# Altium project ECU_AutoRC_r00.PrjPcb
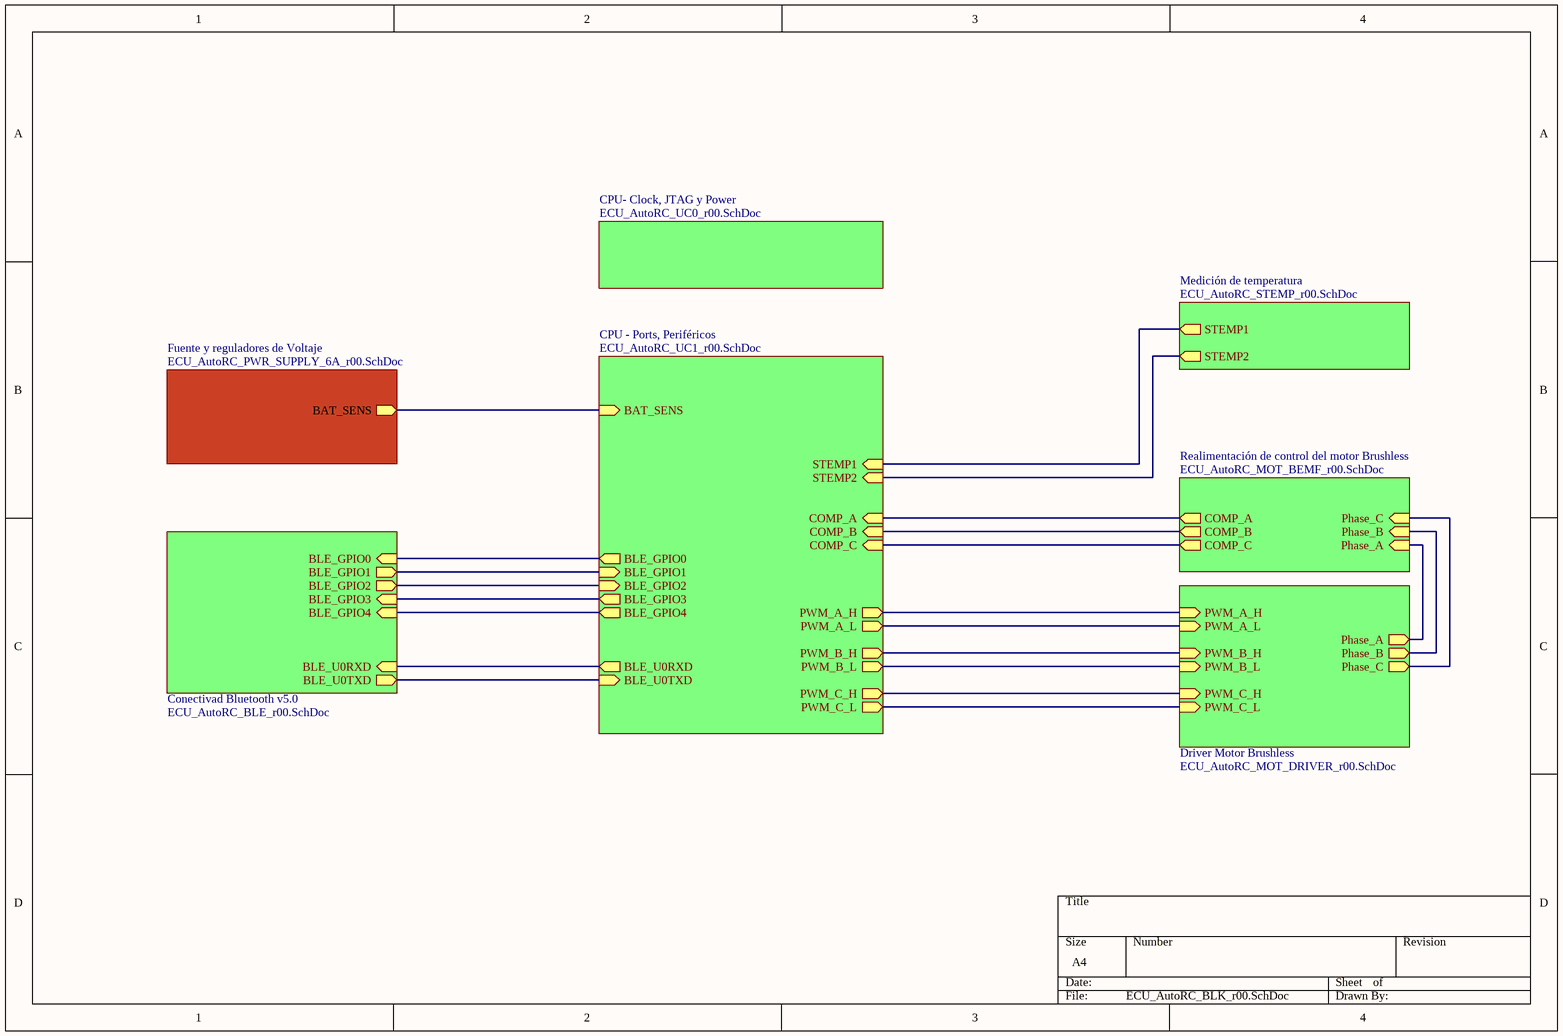
[diagram p0: ECU_AutoRC_BLK_r00.SchDoc]
8 sheets, 179 parts. Net scope: hierarchical (ports join the sheet entries above them; power ports are global).
Board file: ECU_AutoRC_r00.PcbDoc
Sheets:
  ECU_AutoRC_BLK_r00.SchDoc
    Fuente y reguladores de Voltaje = ECU_AutoRC_PWR_SUPPLY_6A_r00.SchDoc
    CPU- Clock, JTAG y Power = ECU_AutoRC_UC0_r00.SchDoc
    CPU - Ports, Periféricos = ECU_AutoRC_UC1_r00.SchDoc
    Medición de temperatura = ECU_AutoRC_STEMP_r00.SchDoc
    Conectivad Bluetooth v5.0 = ECU_AutoRC_BLE_r00.SchDoc
    Driver Motor Brushless = ECU_AutoRC_MOT_DRIVER_r00.SchDoc
    Realimentación de control del motor Brushless = ECU_AutoRC_MOT_BEMF_r00.SchDoc

## Sheet ECU_AutoRC_BLK_r00.SchDoc
size A4; SheetNumber: 1; SheetTotal: 8

### Sub-sheets
Conectivad Bluetooth v5.0 = ECU_AutoRC_BLE_r00.SchDoc: BLE_U0TXD (out), BLE_U0RXD (in), BLE_GPIO1 (out), BLE_GPIO0 (in), BLE_GPIO2 (out), BLE_GPIO3 (in), BLE_GPIO4 (in)
CPU - Ports, Periféricos = ECU_AutoRC_UC1_r00.SchDoc: STEMP1 (in), STEMP2 (in), BLE_GPIO0 (out), BLE_GPIO1 (in), BLE_U0RXD (out), BLE_U0TXD (in), COMP_A (in), COMP_B (in), COMP_C (in), PWM_A_H (out), BAT_SENS (in), PWM_A_L (out), PWM_B_H (out), PWM_B_L (out), PWM_C_H (out), PWM_C_L (out), BLE_GPIO2 (in), BLE_GPIO3 (out), BLE_GPIO4 (out)
CPU- Clock, JTAG y Power = ECU_AutoRC_UC0_r00.SchDoc: no entries
Driver Motor Brushless = ECU_AutoRC_MOT_DRIVER_r00.SchDoc: PWM_C_L (in), PWM_C_H (in), PWM_B_L (in), PWM_B_H (in), PWM_A_L (in), PWM_A_H (in), Phase_A (out), Phase_B (out), Phase_C (out)
Fuente y reguladores de Voltaje = ECU_AutoRC_PWR_SUPPLY_6A_r00.SchDoc: BAT_SENS (out)
Medición de temperatura = ECU_AutoRC_STEMP_r00.SchDoc: STEMP1 (out), STEMP2 (out)
Realimentación de control del motor Brushless = ECU_AutoRC_MOT_BEMF_r00.SchDoc: COMP_A (out), COMP_B (out), COMP_C (out), Phase_A (in), Phase_B (in), Phase_C (in)

### Nets
IO0: sheet CPU - Ports, Periféricos/BLE_GPIO0, sheet Conectivad Bluetooth v5.0/BLE_GPIO0
IO1: sheet CPU - Ports, Periféricos/BLE_GPIO1, sheet Conectivad Bluetooth v5.0/BLE_GPIO1
IO2: sheet CPU - Ports, Periféricos/BLE_GPIO2, sheet Conectivad Bluetooth v5.0/BLE_GPIO2
IO3: sheet CPU - Ports, Periféricos/BLE_GPIO3, sheet Conectivad Bluetooth v5.0/BLE_GPIO3
IO10: sheet CPU - Ports, Periféricos/BLE_GPIO4, sheet Conectivad Bluetooth v5.0/BLE_GPIO4
PH_A: sheet Driver Motor Brushless/Phase_A, sheet Realimentación de control del motor Brushless/Phase_A
PH_B: sheet Driver Motor Brushless/Phase_B, sheet Realimentación de control del motor Brushless/Phase_B
PH_C: sheet Driver Motor Brushless/Phase_C, sheet Realimentación de control del motor Brushless/Phase_C
RXD0: sheet CPU - Ports, Periféricos/BLE_U0RXD, sheet Conectivad Bluetooth v5.0/BLE_U0RXD
TXD0: sheet CPU - Ports, Periféricos/BLE_U0TXD, sheet Conectivad Bluetooth v5.0/BLE_U0TXD
NetR6_1: sheet CPU - Ports, Periféricos/STEMP1, sheet Medición de temperatura/STEMP1
NetR8_2: sheet CPU - Ports, Periféricos/STEMP2, sheet Medición de temperatura/STEMP2
NetR48_2: sheet Fuente y reguladores de Voltaje/BAT_SENS, sheet CPU - Ports, Periféricos/BAT_SENS
NetTP23_1: sheet CPU - Ports, Periféricos/PWM_A_H, sheet Driver Motor Brushless/PWM_A_H
NetTP24_1: sheet CPU - Ports, Periféricos/PWM_A_L, sheet Driver Motor Brushless/PWM_A_L
NetTP26_1: sheet CPU - Ports, Periféricos/PWM_B_H, sheet Driver Motor Brushless/PWM_B_H
NetTP27_1: sheet CPU - Ports, Periféricos/PWM_C_H, sheet Driver Motor Brushless/PWM_C_H
NetTP28_1: sheet CPU - Ports, Periféricos/PWM_B_L, sheet Driver Motor Brushless/PWM_B_L
NetTP29_1: sheet CPU - Ports, Periféricos/PWM_C_L, sheet Driver Motor Brushless/PWM_C_L
NetTP36_1: sheet CPU - Ports, Periféricos/COMP_A, sheet Realimentación de control del motor Brushless/COMP_A
NetTP39_1: sheet CPU - Ports, Periféricos/COMP_B, sheet Realimentación de control del motor Brushless/COMP_B
NetTP40_1: sheet CPU - Ports, Periféricos/COMP_C, sheet Realimentación de control del motor Brushless/COMP_C

## Sheet ECU_AutoRC_PWR_SUPPLY_6A_r00.SchDoc
size A4; SheetNumber: 8; SheetTotal: 8
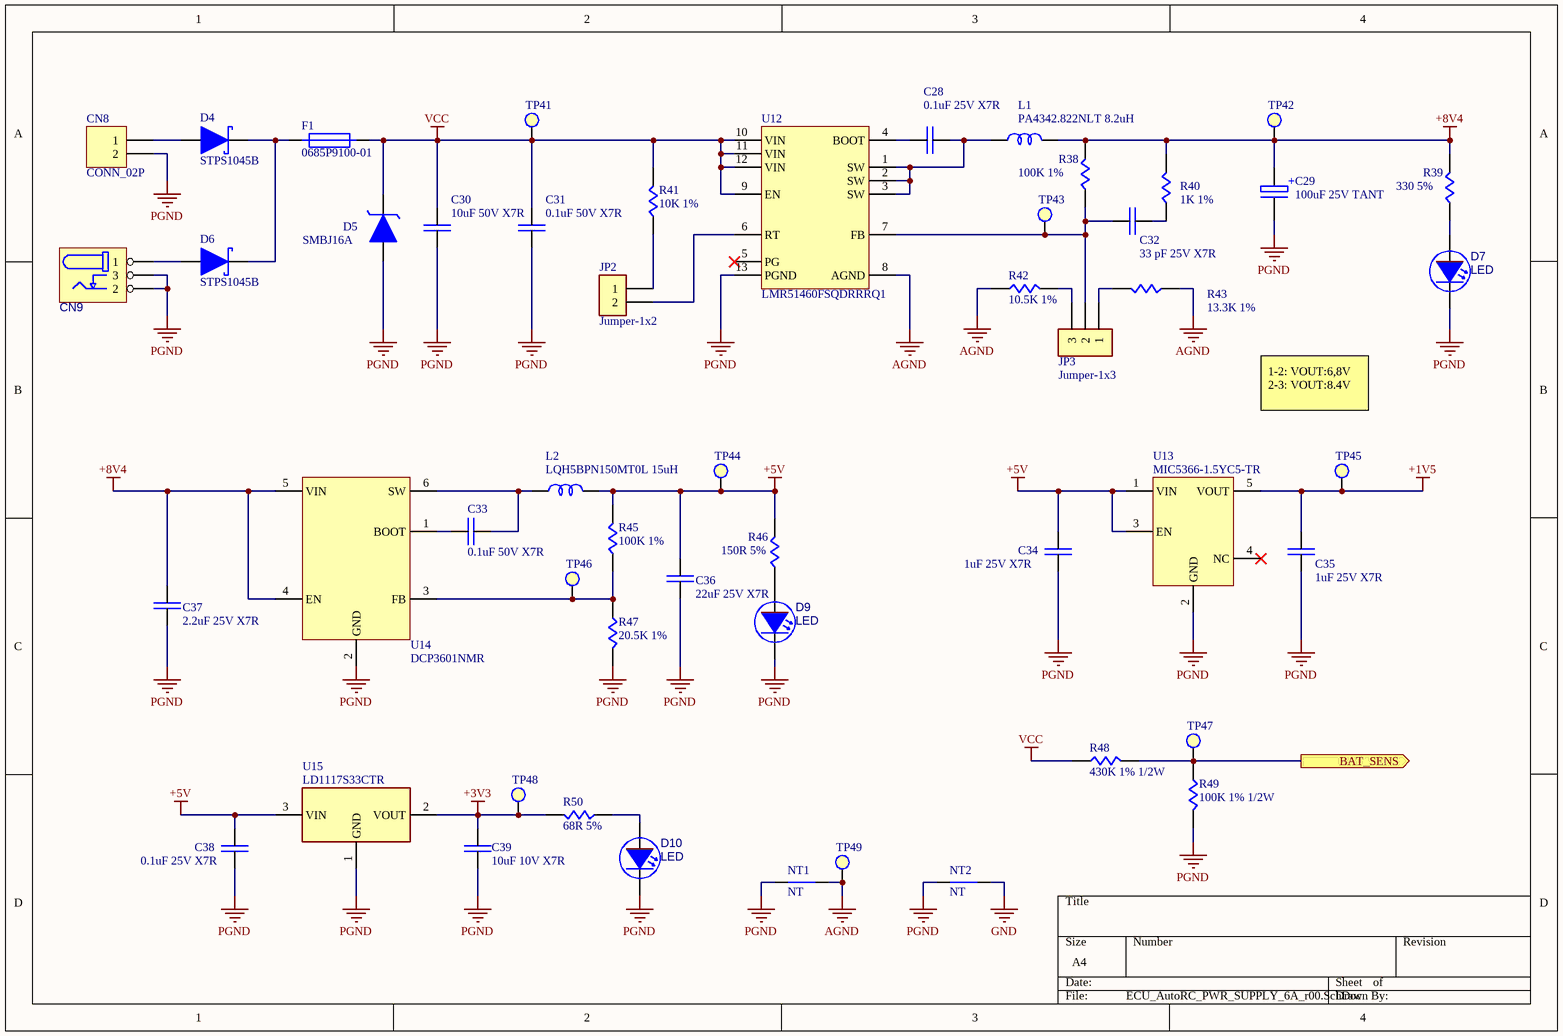
[diagram p1: ECU_AutoRC_PWR_SUPPLY_6A_r00.SchDoc]

### Parts
C28  0.1uF 25V X7R  [C_0805]
C29  100uF 25V TANT  [C_TANT_2917]
C30  10uF 50V X7R  [C_1206]
C31  0.1uF 50V X7R  [C_0805]
C32  33 pF 25V X7R  [C_0805]
C33  0.1uF 50V X7R  [C_0805]
C34  1uF 25V X7R  [C_0805]
C35  1uF 25V X7R  [C_0805]
C36  22uF 25V X7R  [C_0805]
C37  2.2uF 25V X7R  [C_0805]
C38  0.1uF 25V X7R  [C_0805]
C39  10uF 10V X7R  [C_0805]
CN8  CONN_02P  [CONN_BAT]
CN9  CN_PowerJack  [PJ002B]  (value not drawn)
D4  STPS1045B  [TO252_1]
D5  SMBJ16A  [D_SMB]
D6  STPS1045B  [TO252_1]
D7  LED  [LED_0805]
D9  LED  [LED_0805]
D10  LED  [LED_0805]
F1  0685P9100-01  [F_1206]
JP2  Jumper-1x2  [Header_M_1x2_0.1"]
JP3  Jumper-1x3  [Header_M_1x3_0.1"]
L1  PA4342.822NLT 8.2uH  [IND_PA4342.822NLT]
L2  LQH5BPN150MT0L 15uH  [IND_LQH5BPN150MT0L]
NT1  NT  [NET_TIE]
NT2  NT  [NET_TIE]
R38  100K 1%  [R_0805]
R39  330 5%  [R_0805]
R40  1K 1%  [R_0805]
R41  10K 1%  [R_0805]
R42  10.5K 1%  [R_0805]
R43  13.3K 1%  [R_0805]
R45  100K 1%  [R_0805]
R46  150R 5%  [R_0805]
R47  20.5K 1%  [R_0805]
R48  430K 1% 1/2W  [R_1210]
R49  100K 1% 1/2W  [R_1210]
R50  68R 5%  [R_0805]
TP41  Test Point  [TEST_POINT]  (value not drawn)
TP42  Test Point  [TEST_POINT]  (value not drawn)
TP43  Test Point  [TEST_POINT]  (value not drawn)
TP44  Test Point  [TEST_POINT]  (value not drawn)
TP45  Test Point  [TEST_POINT]  (value not drawn)
TP46  Test Point  [TEST_POINT]  (value not drawn)
TP47  Test Point  [TEST_POINT]  (value not drawn)
TP48  Test Point  [TEST_POINT]  (value not drawn)
TP49  Test Point  [TEST_POINT]  (value not drawn)
U12  LMR51460FSQDRRRQ1  [LMR51460FSQDRRRQ1]
U13  MIC5366-1.5YC5-TR  [SC 70-5]
U14  DCP3601NMR  [SOT23-6]
U15  LD1117S33CTR  [SOT-223]

### Ports
BAT_SENS (out, see ECU_AutoRC_BLK_r00[2B], ECU_AutoRC_UC1_r00[4A])

### Nets
+1V5: C35.1 TP45.1 U13.5(VOUT)
+3V3: C39.1 R50.2 TP48.1 U15.2(VOUT)
+5V: C34.1 C36.1 C38.1 L2.2 R45.2 R46.2 TP44.1 U13.1(VIN) U13.3(EN) U15.3(VIN)
+8V4: C29.1 C37.1 L1.2 R38.2 R39.2 R40.2 TP42.1 U14.4(EN) U14.5(VIN)
AGND: NT1.2 R42.1 R43.1 TP49.1 U12.8(AGND)
GND: NT2.2
PGND: C29.2 C30.1 C31.1 C34.2 C35.2 C36.2 C37.2 C38.2 C39.2 CN8.2 CN9.2 CN9.3 D5.1(Anode) D7.2(K) D9.2(K) D10.2(K) NT1.1 NT2.1 R47.2 R49.2 U12.13(PGND) U13.2(GND) U14.2(GND) U15.1(GND)
VCC: C30.2 C31.2 D5.2(Catode) F1.2 R41.2 R48.1 TP41.1 U12.9(EN) U12.10(VIN) U12.11(VIN) U12.12(VIN)
NetC28_1: C28.1 U12.4(BOOT)
NetC28_2: C28.2 L1.1 U12.1(SW) U12.2(SW) U12.3(SW)
NetC32_1: C32.1 JP3.2 R38.1 TP43.1 U12.7(FB)
NetC32_2: C32.2 R40.1
NetC33_1: C33.1 U14.1(BOOT)
NetC33_2: C33.2 L2.1 U14.6(SW)
NetCN8_1: CN8.1 D4.1(Anode)
NetCN9_1: CN9.1 D6.1(Anode)
NetD4_2: D4.2(Catode) D6.2(Catode) F1.1
NetD7_1: D7.1(A) R39.1
NetD9_1: D9.1(A) R46.1
NetD10_1: D10.1(A) R50.1
NetJP2_1: JP2.1 R41.1
NetJP2_2: JP2.2 U12.6(RT)
NetJP3_1: JP3.1 R43.2
NetJP3_3: JP3.3 R42.2
NetR45_1: R45.1 R47.1 TP46.1 U14.3(FB)
NetR48_2: R48.2 R49.1 TP47.1 ; port BAT_SENS

Not connected (* = marked no-connect by the designer): U12 5(PG)*; U13 4(NC)*

### Notes on the sheet
- 1-2: VOUT:6,8V
  2-3: VOUT:8.4V
- (in symbol Capacitor Polarizado) +

### Library data of the parts
C28 C30-C39 = Capacitor NP: Non Polarizated Capacitor
C29 = Capacitor Polarizado: Polarizated Capacitor
CN8 = CONN_02P: 2 Pin Connector
CN9 = CN_PowerJack: Barrel Power Connector
D4 D6 = Diode_Schottky: Diode Schottky
D5 = Diode_Zener: Diode Zener
F1 = FUSE: Fuse | Quick Acting; MF: Bel Fuse; MP: 0679L1000-05; SnapEDA_Link: https://www.snapeda.com/parts/0679L1000-05/Bel+Fuse/view-part/?ref=snap; Package: SMD-2; Price: None; Availability: Unavailable; Check_prices: https://www.snapeda.com/parts/0679L1000-05/Bel+Fuse/view-part/?ref=eda; Value: *
L1 L2 = Inductor
NT1 NT2 = NET_TIE_SMD
R38-R43 R45-R50 = Resistor
TP41-TP49 = TestPoint
U12 = LMR51460FSQDRRRQ1: IC REG BUCK ADJ 6A 12WSON
U13 = MIC5366-1.5YC5-TR: IC REG LINEAR 1.5V 150MA SC-70-5
U15 = LD1117S33CTR: IC REG LINEAR 3.3V 800MA SOT-223

## Sheet ECU_AutoRC_UC0_r00.SchDoc
size A4; SheetNumber: 2; SheetTotal: 9
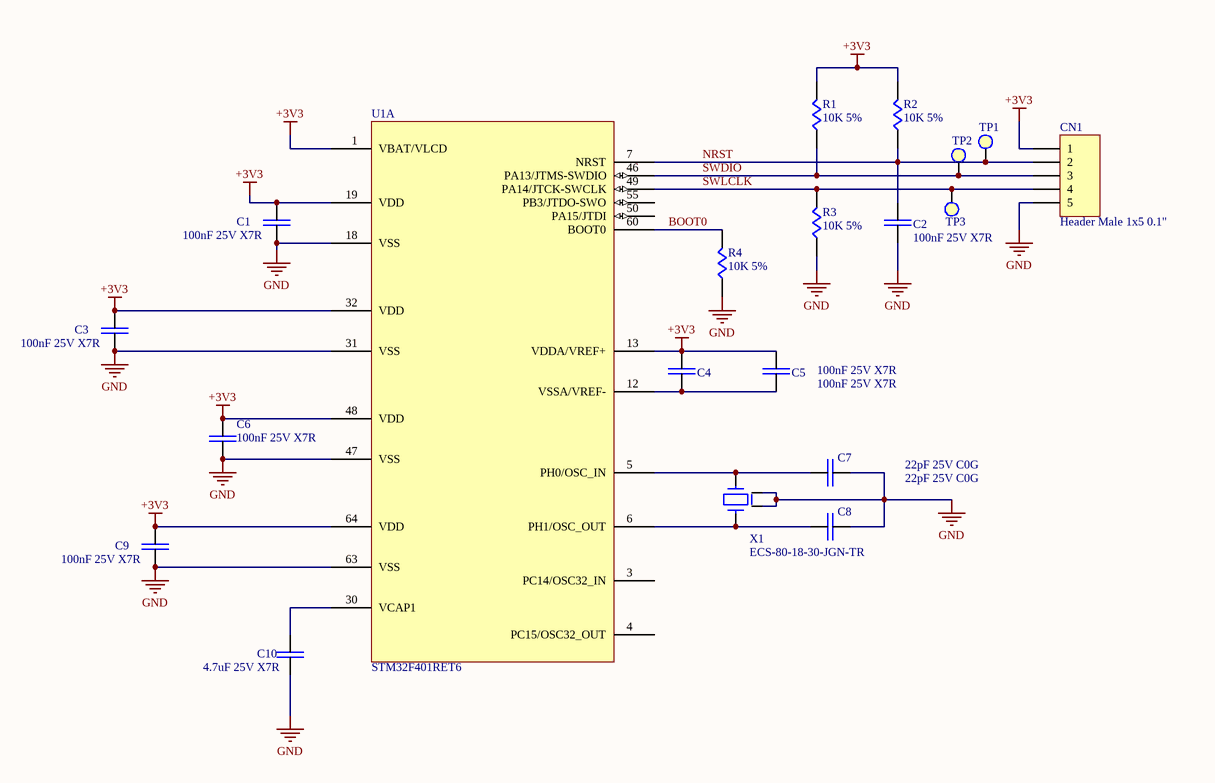
[diagram p2: ECU_AutoRC_UC0_r00.SchDoc]

### Parts
C1  100nF 25V X7R  [C_0805]
C2  100nF 25V X7R  [C_0805]
C3  100nF 25V X7R  [C_0805]
C4  100nF 25V X7R  [C_0805]
C5  100nF 25V X7R  [C_0805]
C6  100nF 25V X7R  [C_0805]
C7  22pF 25V C0G  [C_0805]
C8  22pF 25V C0G  [C_0805]
C9  100nF 25V X7R  [C_0805]
C10  4.7uF 25V X7R  [C_0805]
CN1  Header Male 1x5 0.1"  [Header_M_1x5_2mm]
R1  10K 5%  [R_0805]
R2  10K 5%  [R_0805]
R3  10K 5%  [R_0805]
R4  10K 5%  [R_0805]
TP1  Test Point  [TEST_POINT]  (value not drawn)
TP2  Test Point  [TEST_POINT]  (value not drawn)
TP3  Test Point  [TEST_POINT]  (value not drawn)
U1  STM32F401RET6  [STM32F401T6]  (part A of 2)
X1  ECS-80-18-30-JGN-TR  [XTAL_4N_ECS-80-10]

### Nets
+3V3: C1.2 C3.2 C4.1 C5.1 C6.2 C9.2 CN1.1 R1.2 R2.2 U1.1(VBAT/VLCD) U1.13(VDDA/VREF+) U1.19(VDD) U1.32(VDD) U1.48(VDD) U1.64(VDD)
GND: C1.1 C2.2 C3.1 C6.1 C7.2 C8.2 C9.1 C10.1 CN1.5 R3.1 R4.1 U1.18(VSS) U1.31(VSS) U1.47(VSS) U1.63(VSS) X1.2 X1.4
BOOT0: R4.2 U1.60(BOOT0)
NRST: C2.1 CN1.2 R2.1 TP1.1 U1.7(NRST)
SWDIO: CN1.3 R1.1 TP2.1 U1.46(PA13/JTMS-SWDIO)
SWLCLK: CN1.4 R3.2 TP3.1 U1.49(PA14/JTCK-SWCLK)
NetC4_2: C4.2 C5.2 U1.12(VSSA/VREF-)
NetC7_1: C7.1 U1.5(PH0/OSC_IN) X1.1
NetC8_1: C8.1 U1.6(PH1/OSC_OUT) X1.3
NetC10_2: C10.2 U1.30(VCAP1)

Not connected (* = marked no-connect by the designer): U1 3(PC14/OSC32_IN) 4(PC15/OSC32_OUT) 50(PA15/JTDI) 55(PB3/JTDO-SWO)

### Library data of the parts
C1-C10 = Capacitor NP: Non Polarizated Capacitor
CN1 = CONN_05P: Connector Generic 5 Vias
R1-R4 = Resistor
TP1-TP3 = TestPoint
U1 = STM32F401RE: STM32 Microcontroller
X1 = CRYSTAL_4P: Xtal 4 Ports

## Sheet ECU_AutoRC_UC1_r00.SchDoc
size A4; SheetNumber: 3; SheetTotal: 8
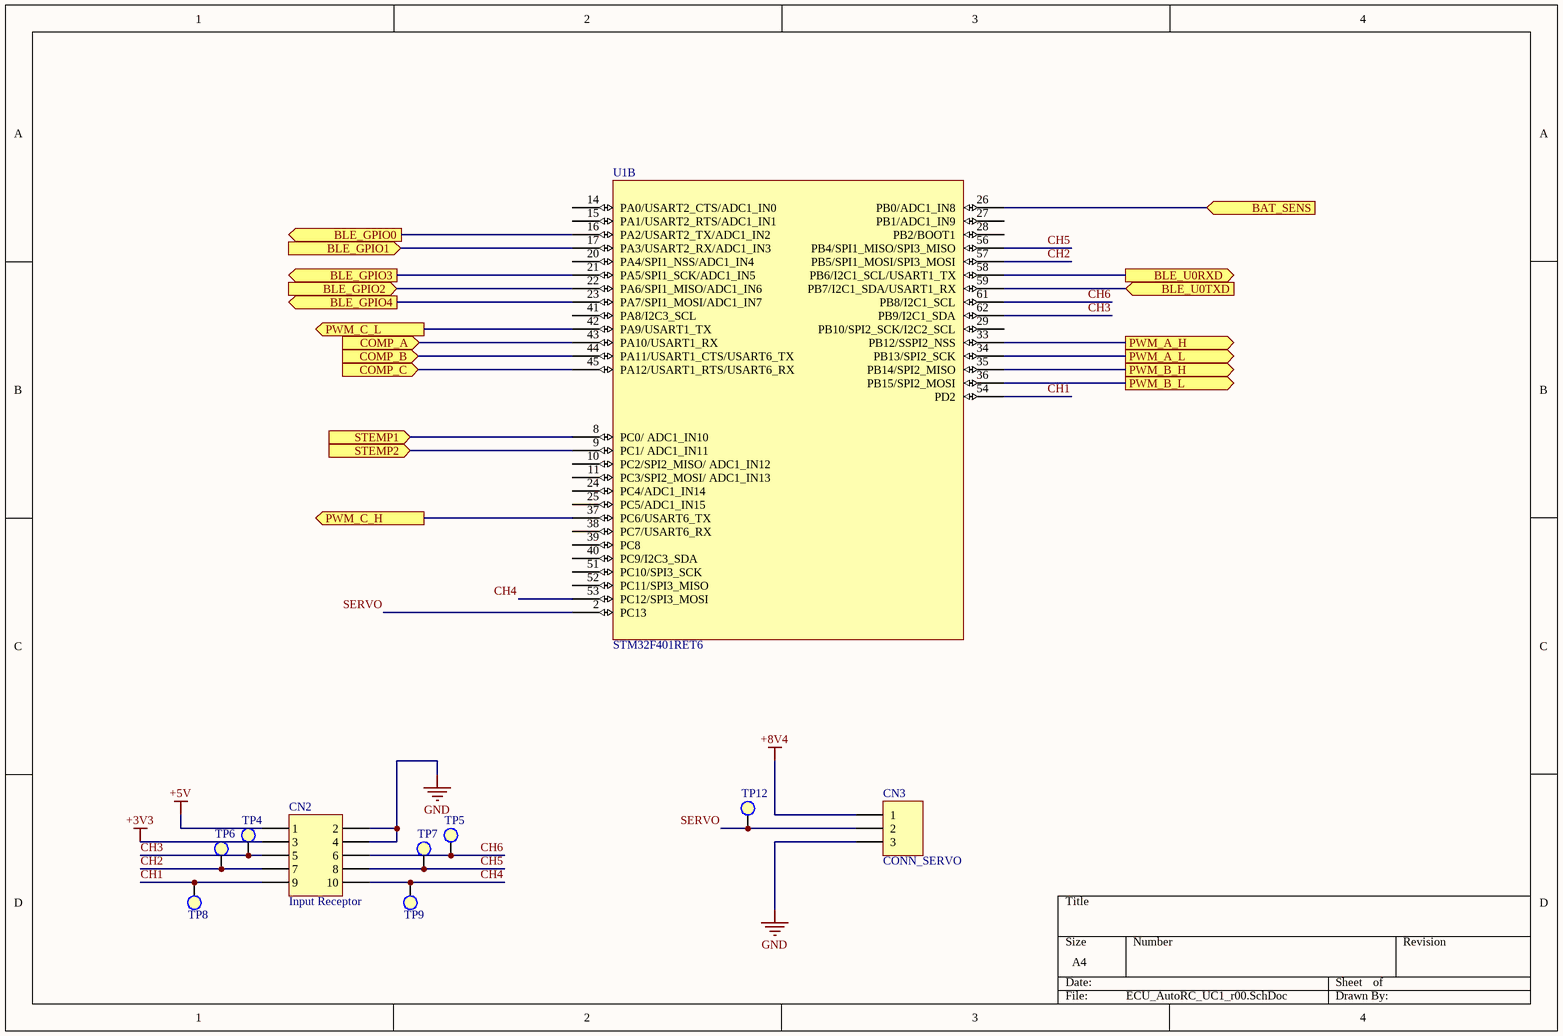
[diagram p3: ECU_AutoRC_UC1_r00.SchDoc]

### Parts
CN2  Input Receptor  [HEADER_M_2X5_2.54MM]
CN3  CONN_SERVO  [HEADER_M_1X3_2.5MM]
TP4  Test Point  [TEST_POINT]  (value not drawn)
TP5  Test Point  [TEST_POINT]  (value not drawn)
TP6  Test Point  [TEST_POINT]  (value not drawn)
TP7  Test Point  [TEST_POINT]  (value not drawn)
TP8  Test Point  [TEST_POINT]  (value not drawn)
TP9  Test Point  [TEST_POINT]  (value not drawn)
TP12  Test Point  [TEST_POINT]  (value not drawn)
U1  STM32F401RET6  [STM32F401T6]  (part B of 2)

### Ports
BAT_SENS (in, see ECU_AutoRC_BLK_r00[2B], ECU_AutoRC_PWR_SUPPLY_6A_r00[4C]), BLE_GPIO0 (out, see ECU_AutoRC_BLK_r00[2C], ECU_AutoRC_BLE_r00[1C]), BLE_GPIO1 (in, see ECU_AutoRC_BLK_r00[2C], ECU_AutoRC_BLE_r00[1C]), BLE_GPIO2 (in, see ECU_AutoRC_BLK_r00[2C], ECU_AutoRC_BLE_r00[1C]), BLE_GPIO3 (out, see ECU_AutoRC_BLK_r00[2C], ECU_AutoRC_BLE_r00[1C]), BLE_GPIO4 (out, see ECU_AutoRC_BLK_r00[2C], ECU_AutoRC_BLE_r00[1D]), BLE_U0RXD (out, see ECU_AutoRC_BLK_r00[2C], ECU_AutoRC_BLE_r00[1D]), BLE_U0TXD (in, see ECU_AutoRC_BLK_r00[2C], ECU_AutoRC_BLE_r00[1D]), COMP_A (in, see ECU_AutoRC_BLK_r00[3C], ECU_AutoRC_MOT_BEMF_r00[2C]), COMP_B (in, see ECU_AutoRC_BLK_r00[3C], ECU_AutoRC_MOT_BEMF_r00[2C]), COMP_C (in, see ECU_AutoRC_BLK_r00[3C], ECU_AutoRC_MOT_BEMF_r00[2D]), PWM_A_H (out, see ECU_AutoRC_BLK_r00[3C], ECU_AutoRC_MOT_DRIVER_r00[1A]), PWM_A_L (out, see ECU_AutoRC_BLK_r00[3C], ECU_AutoRC_MOT_DRIVER_r00[1A]), PWM_B_H (out, see ECU_AutoRC_BLK_r00[3C], ECU_AutoRC_MOT_DRIVER_r00[1B]), PWM_B_L (out, see ECU_AutoRC_BLK_r00[3C], ECU_AutoRC_MOT_DRIVER_r00[1B]), PWM_C_H (out, see ECU_AutoRC_BLK_r00[3C], ECU_AutoRC_MOT_DRIVER_r00[1B]), PWM_C_L (out, see ECU_AutoRC_BLK_r00[3C], ECU_AutoRC_MOT_DRIVER_r00[1B]), STEMP1 (in, see ECU_AutoRC_BLK_r00[3B], ECU_AutoRC_STEMP_r00[2A]), STEMP2 (in, see ECU_AutoRC_BLK_r00[3B], ECU_AutoRC_STEMP_r00[4A])

### Nets
+3V3: CN2.3
+5V: CN2.1
+8V4: CN3.1
GND: CN2.2 CN2.4 CN3.3
CH1: CN2.9 TP8.1 U1.54(PD2)
CH2: CN2.7 TP6.1 U1.57(PB5/SPI1_MOSI/SPI3_MOSI)
CH3: CN2.5 TP4.1 U1.62(PB9/I2C1_SDA)
CH4: CN2.10 TP9.1 U1.53(PC12/SPI3_MOSI)
CH5: CN2.8 TP7.1 U1.56(PB4/SPI1_MISO/SPI3_MISO)
CH6: CN2.6 TP5.1 U1.61(PB8/I2C1_SCL)
IO0: U1.16(PA2/USART2_TX/ADC1_IN2) ; port BLE_GPIO0
IO1: U1.17(PA3/USART2_RX/ADC1_IN3) ; port BLE_GPIO1
IO2: U1.22(PA6/SPI1_MISO/ADC1_IN6) ; port BLE_GPIO2
IO3: U1.21(PA5/SPI1_SCK/ADC1_IN5) ; port BLE_GPIO3
IO10: U1.23(PA7/SPI1_MOSI/ADC1_IN7) ; port BLE_GPIO4
RXD0: U1.58(PB6/I2C1_SCL/USART1_TX) ; port BLE_U0RXD
SERVO: CN3.2 TP12.1 U1.2(PC13)
TXD0: U1.59(PB7/I2C1_SDA/USART1_RX) ; port BLE_U0TXD
NetR6_1: U1.8(PC0/_ADC1_IN10) ; port STEMP1
NetR8_2: U1.9(PC1/_ADC1_IN11) ; port STEMP2
NetR48_2: U1.26(PB0/ADC1_IN8) ; port BAT_SENS
NetTP23_1: U1.33(PB12/SSPI2_NSS) ; port PWM_A_H
NetTP24_1: U1.34(PB13/SPI2_SCK) ; port PWM_A_L
NetTP26_1: U1.35(PB14/SPI2_MISO) ; port PWM_B_H
NetTP27_1: U1.37(PC6/USART6_TX) ; port PWM_C_H
NetTP28_1: U1.36(PB15/SPI2_MOSI) ; port PWM_B_L
NetTP29_1: U1.42(PA9/USART1_TX) ; port PWM_C_L
NetTP36_1: U1.43(PA10/USART1_RX) ; port COMP_A
NetTP39_1: U1.44(PA11/USART1_CTS/USART6_TX) ; port COMP_B
NetTP40_1: U1.45(PA12/USART1_RTS/USART6_RX) ; port COMP_C

Not connected (* = marked no-connect by the designer): U1 10(PC2/SPI2_MISO/_ADC1_IN12) 11(PC3/SPI2_MOSI/_ADC1_IN13) 14(PA0/USART2_CTS/ADC1_IN0) 15(PA1/USART2_RTS/ADC1_IN1) 20(PA4/SPI1_NSS/ADC1_IN4) 24(PC4/ADC1_IN14) 25(PC5/ADC1_IN15) 27(PB1/ADC1_IN9) 28(PB2/BOOT1) 29(PB10/SPI2_SCK/I2C2_SCL) 38(PC7/USART6_RX) 39(PC8) 40(PC9/I2C3_SDA) 41(PA8/I2C3_SCL) 51(PC10/SPI3_SCK) 52(PC11/SPI3_MISO)

### Library data of the parts
CN2 = CONN_10P: Connector Generic 10 Vias
CN3 = CONN_03P: 3 Pin Connector
TP4-TP9 TP12 = TestPoint
U1 = STM32F401RE: STM32 Microcontroller

## Sheet ECU_AutoRC_STEMP_r00.SchDoc
size A4; SheetNumber: 5; SheetTotal: 9
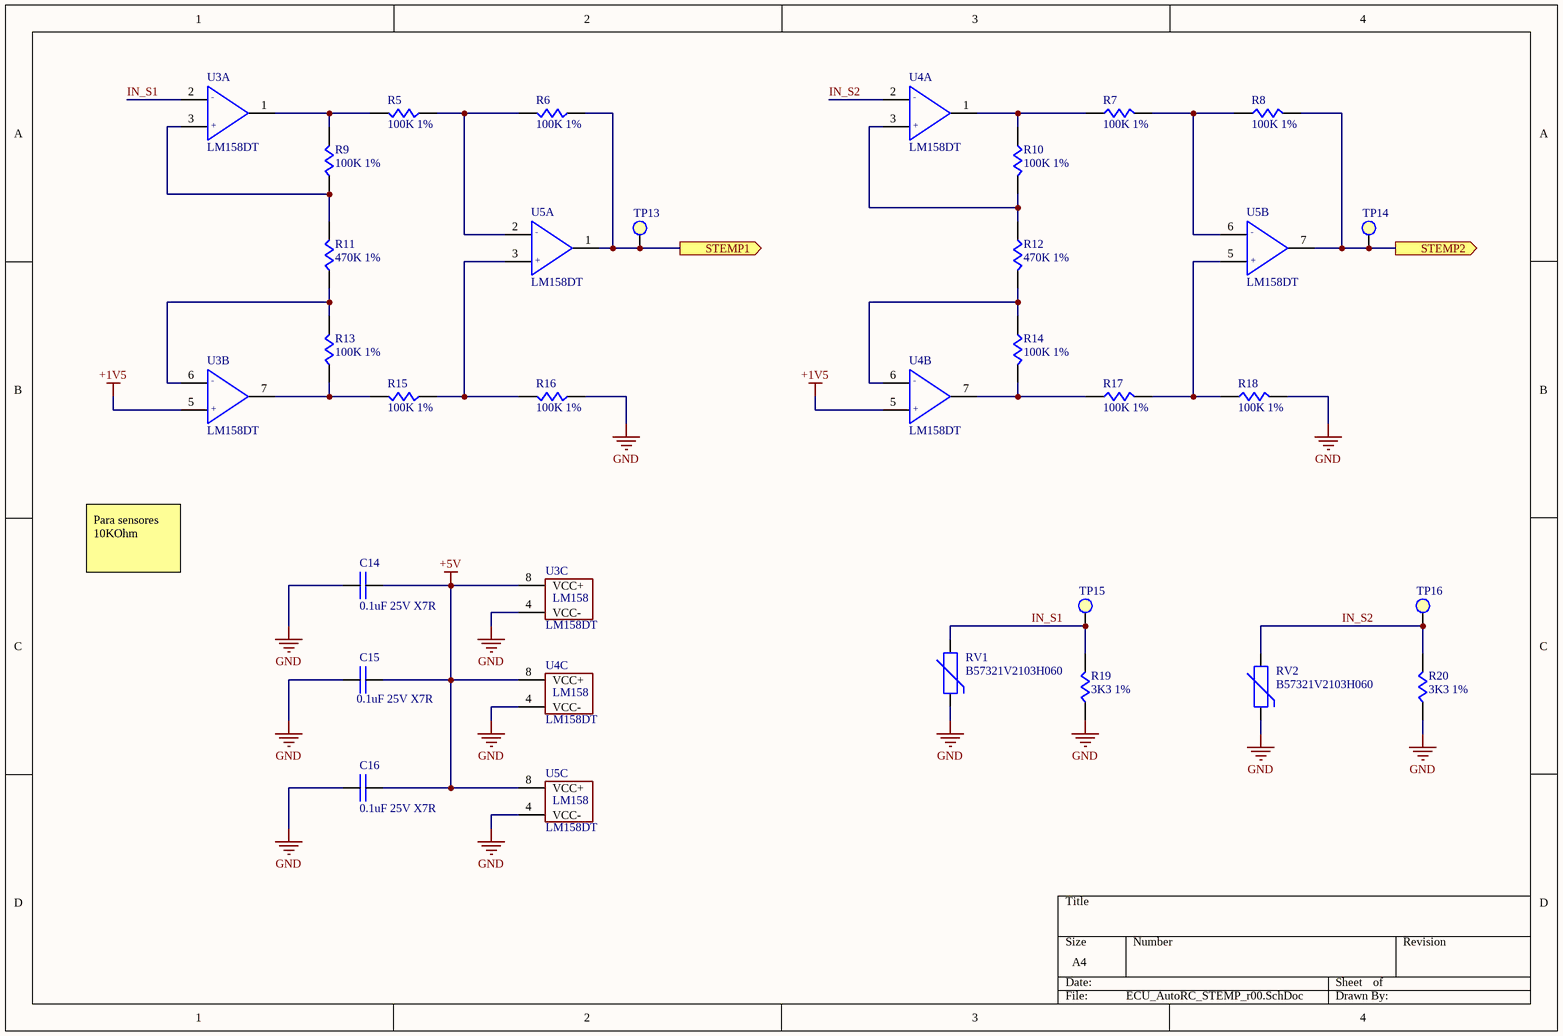
[diagram p4: ECU_AutoRC_STEMP_r00.SchDoc]

### Parts
C14  0.1uF 25V X7R  [C_0805]
C15  0.1uF 25V X7R  [C_0805]
C16  0.1uF 25V X7R  [C_0805]
R5  100K 1%  [R_0805]
R6  100K 1%  [R_0805]
R7  100K 1%  [R_0805]
R8  100K 1%  [R_0805]
R9  100K 1%  [R_0805]
R10  100K 1%  [R_0805]
R11  470K 1%  [R_0805]
R12  470K 1%  [R_0805]
R13  100K 1%  [R_0805]
R14  100K 1%  [R_0805]
R15  100K 1%  [R_0805]
R16  100K 1%  [R_0805]
R17  100K 1%  [R_0805]
R18  100K 1%  [R_0805]
R19  3K3 1%  [R_0805]
R20  3K3 1%  [R_0805]
RV1  B57321V2103H060  [R_0603]
RV2  B57321V2103H060  [R_0603]
TP13  Test Point  [TEST_POINT]  (value not drawn)
TP14  Test Point  [TEST_POINT]  (value not drawn)
TP15  Test Point  [TEST_POINT]  (value not drawn)
TP16  Test Point  [TEST_POINT]  (value not drawn)
U3  LM158DT  [IC_SO8]  (parts A,B,C of 3)
U4  LM158DT  [IC_SO8]  (parts A,B,C of 3)
U5  LM158DT  [IC_SO8]  (parts A,B,C of 3)

### Ports
STEMP1 (out, see ECU_AutoRC_BLK_r00[4B], ECU_AutoRC_UC1_r00[1B]), STEMP2 (out, see ECU_AutoRC_BLK_r00[4B], ECU_AutoRC_UC1_r00[1B])

### Nets
+1V5: U3.5(IN2+) U4.5(IN2+)
+5V: C14.1 C15.1 C16.1 U3.8(VCC+) U4.8(VCC+) U5.8(VCC+)
GND: C14.2 C15.2 C16.2 R16.1 R18.2 R19.1 R20.1 RV1.1 RV2.1 U3.4(VCC-) U4.4(VCC-) U5.4(VCC-)
IN_S1: R19.2 RV1.2 TP15.1 U3.2(IN1-)
IN_S2: R20.2 RV2.2 TP16.1 U4.2(IN1-)
NetR5_1: R5.1 R6.2 U5.2(IN1-)
NetR5_2: R5.2 R9.2 U3.1(OUT1)
NetR6_1: R6.1 TP13.1 U5.1(OUT1) ; port STEMP1
NetR7_1: R7.1 R10.1 U4.1(OUT1)
NetR7_2: R7.2 R8.1 U5.6(IN2-)
NetR8_2: R8.2 TP14.1 U5.7(OUT2) ; port STEMP2
NetR9_1: R9.1 R11.2 U3.3(IN1+)
NetR10_2: R10.2 R12.1 U4.3(IN1+)
NetR11_1: R11.1 R13.2 U3.6(IN2-)
NetR12_2: R12.2 R14.1 U4.6(IN2-)
NetR13_1: R13.1 R15.2 U3.7(OUT2)
NetR14_2: R14.2 R17.1 U4.7(OUT2)
NetR15_1: R15.1 R16.2 U5.3(IN1+)
NetR17_2: R17.2 R18.1 U5.5(IN2+)

### Notes on the sheet
- Para sensores 10KOhm
- (in symbol LM158, part A) -; +
- (in symbol LM158, part B) -; +

### Library data of the parts
C14-C16 = Capacitor NP: Non Polarizated Capacitor
R5-R20 = Resistor
RV1 RV2 = Thermistor
TP13-TP16 = TestPoint
U3-U5 = LM158: Intrumentation Amplifier

## Sheet ECU_AutoRC_BLE_r00.SchDoc
size A4; SheetNumber: 6; SheetTotal: 9
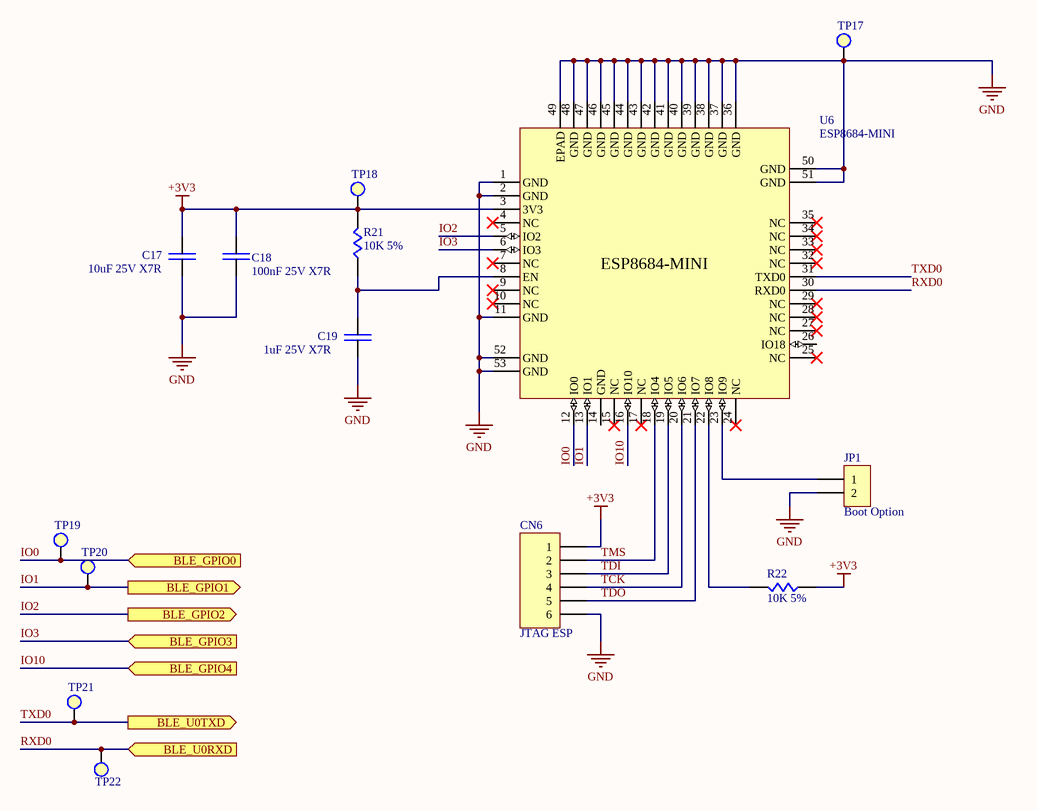
[diagram p5: ECU_AutoRC_BLE_r00.SchDoc]

### Parts
C17  10uF 25V X7R  [C_0805]
C18  100nF 25V X7R  [C_0805]
C19  1uF 25V X7R  [C_0805]
CN6  JTAG ESP  [HEADER_2x3_2.5MM]
JP1  Boot Option  [Header_M_1x2_0.1"]
R21  10K 5%  [R_0805]
R22  10K 5%  [R_0805]
TP17  Test Point  [TEST_POINT]  (value not drawn)
TP18  Test Point  [TEST_POINT]  (value not drawn)
TP19  Test Point  [TEST_POINT]  (value not drawn)
TP20  Test Point  [TEST_POINT]  (value not drawn)
TP21  Test Point  [TEST_POINT]  (value not drawn)
TP22  Test Point  [TEST_POINT]  (value not drawn)
U6  ESP8684-MINI  [ESP8684-MINI]

### Ports
BLE_GPIO0 (in, see ECU_AutoRC_BLK_r00[2C], ECU_AutoRC_UC1_r00[1A]), BLE_GPIO1 (out, see ECU_AutoRC_BLK_r00[2C], ECU_AutoRC_UC1_r00[1A]), BLE_GPIO2 (out, see ECU_AutoRC_BLK_r00[2C], ECU_AutoRC_UC1_r00[1B]), BLE_GPIO3 (in, see ECU_AutoRC_BLK_r00[2C], ECU_AutoRC_UC1_r00[1B]), BLE_GPIO4 (in, see ECU_AutoRC_BLK_r00[2C], ECU_AutoRC_UC1_r00[1B]), BLE_U0RXD (in, see ECU_AutoRC_BLK_r00[2C], ECU_AutoRC_UC1_r00[3B]), BLE_U0TXD (out, see ECU_AutoRC_BLK_r00[2C], ECU_AutoRC_UC1_r00[3B])

### Nets
+3V3: C17.1 C18.1 CN6.1 R21.2 R22.1 TP18.1 U6.3(3V3)
GND: C17.2 C18.2 C19.2 CN6.6 JP1.2 TP17.1 U6.1(GND) U6.2(GND) U6.11(GND) U6.36(GND) U6.37(GND) U6.38(GND) U6.39(GND) U6.40(GND) U6.41(GND) U6.42(GND) U6.43(GND) U6.44(GND) U6.45(GND) U6.46(GND) U6.47(GND) U6.48(GND) U6.49(EPAD) U6.50(GND) U6.51(GND) U6.52(GND) U6.53(GND)
IO0: TP19.1 U6.12(IO0) ; port BLE_GPIO0
IO1: TP20.1 U6.13(IO1) ; port BLE_GPIO1
IO2: U6.5(IO2) ; port BLE_GPIO2
IO3: U6.6(IO3) ; port BLE_GPIO3
IO10: U6.16(IO10) ; port BLE_GPIO4
RXD0: TP22.1 U6.30(RXD0) ; port BLE_U0RXD
TCK: CN6.4 U6.20(IO6)
TDI: CN6.3 U6.19(IO5)
TDO: CN6.5 U6.21(IO7)
TMS: CN6.2 U6.18(IO4)
TXD0: TP21.1 U6.31(TXD0) ; port BLE_U0TXD
NetC19_1: C19.1 R21.1 U6.8(EN)
NetJP1_1: JP1.1 U6.23(IO9)
NetR22_2: R22.2 U6.22(IO8)

Not connected (* = marked no-connect by the designer): U6 4(NC)* 7(NC)* 9(NC)* 10(NC)* 14(GND) 15(NC)* 17(NC)* 24(NC)* 25(NC)* 26(IO18) 27(NC)* 28(NC)* 29(NC)* 32(NC)* 33(NC)* 34(NC)* 35(NC)*

### Library data of the parts
C17-C19 = Capacitor NP: Non Polarizated Capacitor
CN6 = CONN_06P: Connector Generic 6 Vias
JP1 = Jumper
R21 R22 = Resistor
TP17-TP22 = TestPoint

## Sheet ECU_AutoRC_MOT_DRIVER_r00.SchDoc
size A4; SheetNumber: 7; SheetTotal: 9
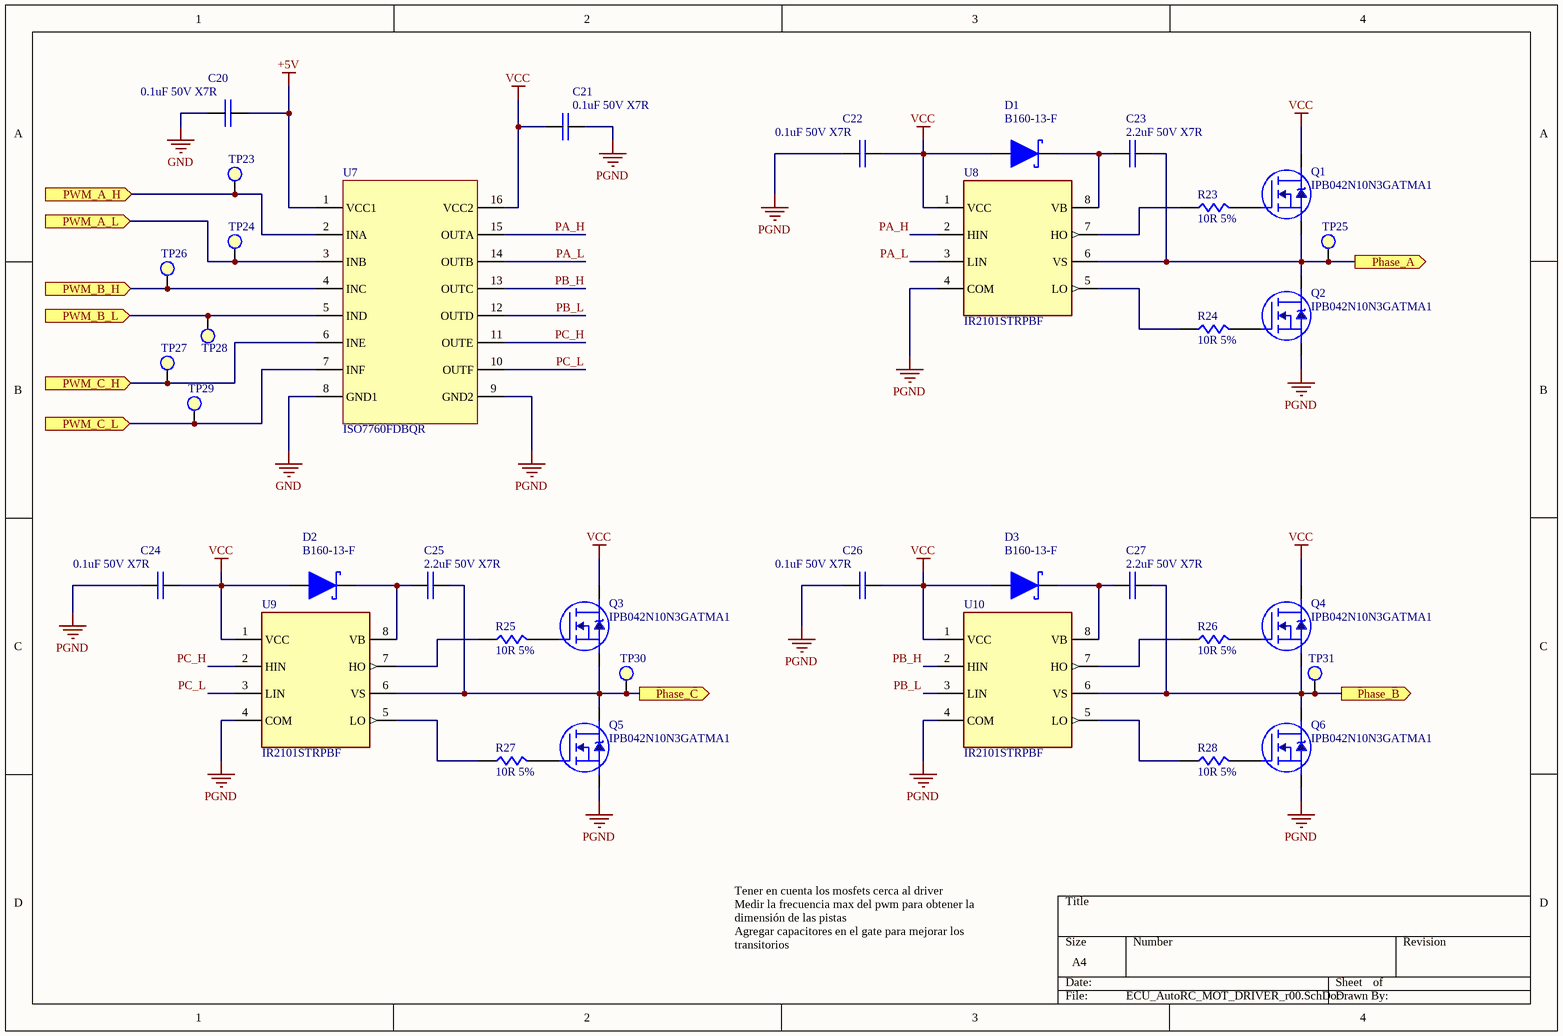
[diagram p6: ECU_AutoRC_MOT_DRIVER_r00.SchDoc]

### Parts
C20  0.1uF 50V X7R  [C_0805]
C21  0.1uF 50V X7R  [C_0805]
C22  0.1uF 50V X7R  [C_0805]
C23  2.2uF 50V X7R  [C_0805]
C24  0.1uF 50V X7R  [C_0805]
C25  2.2uF 50V X7R  [C_0805]
C26  0.1uF 50V X7R  [C_0805]
C27  2.2uF 50V X7R  [C_0805]
D1  B160-13-F  [D_SMA]
D2  B160-13-F  [D_SMA]
D3  B160-13-F  [D_SMA]
Q1  IPB042N10N3GATMA1  [TO263-3]
Q2  IPB042N10N3GATMA1  [TO263-3]
Q3  IPB042N10N3GATMA1  [TO263-3]
Q4  IPB042N10N3GATMA1  [TO263-3]
Q5  IPB042N10N3GATMA1  [TO263-3]
Q6  IPB042N10N3GATMA1  [TO263-3]
R23  10R 5%  [R_0805]
R24  10R 5%  [R_0805]
R25  10R 5%  [R_0805]
R26  10R 5%  [R_0805]
R27  10R 5%  [R_0805]
R28  10R 5%  [R_0805]
TP23  Test Point  [TEST_POINT]  (value not drawn)
TP24  Test Point  [TEST_POINT]  (value not drawn)
TP25  Test Point  [TEST_POINT]  (value not drawn)
TP26  Test Point  [TEST_POINT]  (value not drawn)
TP27  Test Point  [TEST_POINT]  (value not drawn)
TP28  Test Point  [TEST_POINT]  (value not drawn)
TP29  Test Point  [TEST_POINT]  (value not drawn)
TP30  Test Point  [TEST_POINT]  (value not drawn)
TP31  Test Point  [TEST_POINT]  (value not drawn)
U7  ISO7760FDBQR  [IC_SSOP16]
U8  IR2101STRPBF  [IC_8SOIC]
U9  IR2101STRPBF  [IC_8SOIC]
U10  IR2101STRPBF  [IC_8SOIC]

### Ports
Phase_A (out, see ECU_AutoRC_BLK_r00[4C], ECU_AutoRC_MOT_BEMF_r00[1A]), Phase_B (out, see ECU_AutoRC_BLK_r00[4C], ECU_AutoRC_MOT_BEMF_r00[1A]), Phase_C (out, see ECU_AutoRC_BLK_r00[4C], ECU_AutoRC_MOT_BEMF_r00[1A]), PWM_A_H (in, see ECU_AutoRC_BLK_r00[4C], ECU_AutoRC_UC1_r00[1B]), PWM_A_L (in, see ECU_AutoRC_BLK_r00[4C], ECU_AutoRC_UC1_r00[1B]), PWM_B_H (in, see ECU_AutoRC_BLK_r00[4C], ECU_AutoRC_UC1_r00[1B]), PWM_B_L (in, see ECU_AutoRC_BLK_r00[4C], ECU_AutoRC_UC1_r00[1B]), PWM_C_H (in, see ECU_AutoRC_BLK_r00[4C], ECU_AutoRC_UC1_r00[1B]), PWM_C_L (in, see ECU_AutoRC_BLK_r00[4C], ECU_AutoRC_UC1_r00[1B])

### Nets
+5V: C20.2 U7.1(VCC1)
GND: C20.1 U7.8(GND1)
PGND: C21.1 C22.1 C24.1 C26.1 Q2.3(SOURCE) Q5.3(SOURCE) Q6.3(SOURCE) U7.9(GND2) U8.4(COM) U9.4(COM) U10.4(COM)
VCC: C21.2 C22.2 C24.2 C26.2 D1.1(Anode) D2.1(Anode) D3.1(Anode) Q1.2(DRAIN) Q3.2(DRAIN) Q4.2(DRAIN) U7.16(VCC2) U8.1(VCC) U9.1(VCC) U10.1(VCC)
PA_H: U7.15(OUTA) U8.2(HIN)
PA_L: U7.14(OUTB) U8.3(LIN)
PB_H: U7.13(OUTC) U10.2(HIN)
PB_L: U7.12(OUTD) U10.3(LIN)
PC_H: U7.11(OUTE) U9.2(HIN)
PC_L: U7.10(OUTF) U9.3(LIN)
PH_A: C23.2 Q1.3(SOURCE) Q2.2(DRAIN) TP25.1 U8.6(VS) ; port Phase_A
PH_B: C27.2 Q4.3(SOURCE) Q6.2(DRAIN) TP31.1 U10.6(VS) ; port Phase_B
PH_C: C25.2 Q3.3(SOURCE) Q5.2(DRAIN) TP30.1 U9.6(VS) ; port Phase_C
NetC23_1: C23.1 D1.2(Catode) U8.8(VB)
NetC25_1: C25.1 D2.2(Catode) U9.8(VB)
NetC27_1: C27.1 D3.2(Catode) U10.8(VB)
NetQ1_1: Q1.1(GATE) R23.2
NetQ2_1: Q2.1(GATE) R24.2
NetQ3_1: Q3.1(GATE) R25.2
NetQ4_1: Q4.1(GATE) R26.2
NetQ5_1: Q5.1(GATE) R27.2
NetQ6_1: Q6.1(GATE) R28.2
NetR23_1: R23.1 U8.7(HO)
NetR24_1: R24.1 U8.5(LO)
NetR25_1: R25.1 U9.7(HO)
NetR26_1: R26.1 U10.7(HO)
NetR27_1: R27.1 U9.5(LO)
NetR28_1: R28.1 U10.5(LO)
NetTP23_1: TP23.1 U7.2(INA) ; port PWM_A_H
NetTP24_1: TP24.1 U7.3(INB) ; port PWM_A_L
NetTP26_1: TP26.1 U7.4(INC) ; port PWM_B_H
NetTP27_1: TP27.1 U7.6(INE) ; port PWM_C_H
NetTP28_1: TP28.1 U7.5(IND) ; port PWM_B_L
NetTP29_1: TP29.1 U7.7(INF) ; port PWM_C_L

### Notes on the sheet
- Tener en cuenta los mosfets cerca al driver
  Medir la frecuencia max del pwm para obtener la dimensión de las pistas
  Agregar capacitores en el gate para mejorar los transitorios

### Library data of the parts
C20-C27 = Capacitor NP: Non Polarizated Capacitor
D1-D3 = Diode_Schottky: Diode Schottky
Q1-Q6 = NMOS: Mosfet N
R23-R28 = Resistor
TP23-TP31 = TestPoint
U7 = ISO7760FDBQR: DGTL ISOLTR 3KV 6CH GP 16-SSOP
U8-U10 = IR2101STRPBF: Half-Bridge Gate Driver IC Non-Inverting 8-SOIC

## Sheet ECU_AutoRC_MOT_BEMF_r00.SchDoc
size A4; SheetNumber: 8; SheetTotal: 9
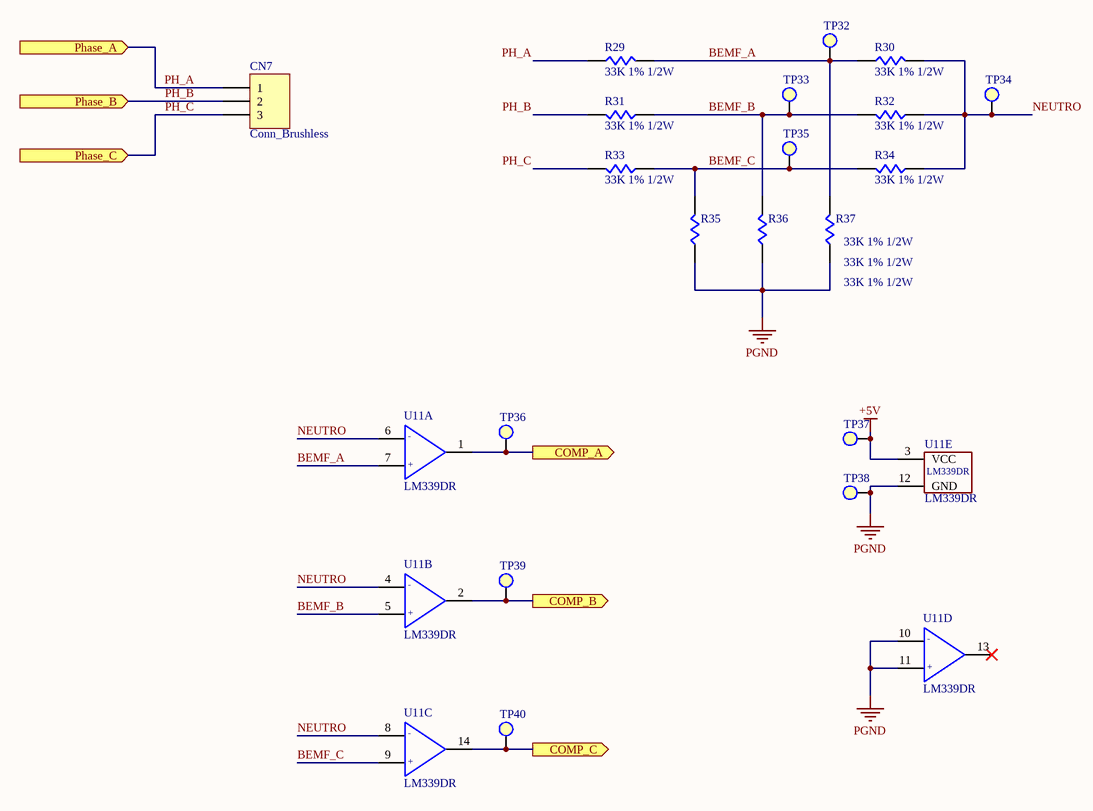
[diagram p7: ECU_AutoRC_MOT_BEMF_r00.SchDoc]

### Parts
CN7  Conn_Brushless  [CONN_BRUSHLESS]
R29  33K 1% 1/2W  [R_0805]
R30  33K 1% 1/2W  [R_0805]
R31  33K 1% 1/2W  [R_0805]
R32  33K 1% 1/2W  [R_0805]
R33  33K 1% 1/2W  [R_0805]
R34  33K 1% 1/2W  [R_0805]
R35  33K 1% 1/2W  [R_0805]
R36  33K 1% 1/2W  [R_0805]
R37  33K 1% 1/2W  [R_0805]
TP32  Test Point  [TEST_POINT]  (value not drawn)
TP33  Test Point  [TEST_POINT]  (value not drawn)
TP34  Test Point  [TEST_POINT]  (value not drawn)
TP35  Test Point  [TEST_POINT]  (value not drawn)
TP36  Test Point  [TEST_POINT]  (value not drawn)
TP37  Test Point  [TEST_POINT]  (value not drawn)
TP38  Test Point  [TEST_POINT]  (value not drawn)
TP39  Test Point  [TEST_POINT]  (value not drawn)
TP40  Test Point  [TEST_POINT]  (value not drawn)
U11  LM339DR  [SOIC14]  (parts A,B,C,D,E of 5)

### Ports
COMP_A (out, see ECU_AutoRC_BLK_r00[4C], ECU_AutoRC_UC1_r00[1C]), COMP_B (out, see ECU_AutoRC_BLK_r00[4C], ECU_AutoRC_UC1_r00[1C]), COMP_C (out, see ECU_AutoRC_BLK_r00[4C], ECU_AutoRC_UC1_r00[1C]), Phase_A (in, see ECU_AutoRC_BLK_r00[4C], ECU_AutoRC_MOT_DRIVER_r00[4B]), Phase_B (in, see ECU_AutoRC_BLK_r00[4C], ECU_AutoRC_MOT_DRIVER_r00[4C]), Phase_C (in, see ECU_AutoRC_BLK_r00[4C], ECU_AutoRC_MOT_DRIVER_r00[2C])

### Nets
+5V: TP37.1 U11.3(VCC)
PGND: R35.1 R36.1 R37.1 TP38.1 U11.10(IN4-) U11.11(IN4+) U11.12(GND)
BEMF_A: R29.2 R30.1 R37.2 TP32.1 U11.7(IN1+)
BEMF_B: R31.1 R32.2 R36.2 TP33.1 U11.5(IN2+)
BEMF_C: R33.1 R34.2 R35.2 TP35.1 U11.9(IN3+)
NEUTRO: R30.2 R32.1 R34.1 TP34.1 U11.4(IN2-) U11.6(IN1-) U11.8(IN3-)
PH_A: CN7.1 R29.1 ; port Phase_A
PH_B: CN7.2 R31.2 ; port Phase_B
PH_C: CN7.3 R33.2 ; port Phase_C
NetTP36_1: TP36.1 U11.1(OUT1) ; port COMP_A
NetTP39_1: TP39.1 U11.2(OUT2) ; port COMP_B
NetTP40_1: TP40.1 U11.14(OUT3) ; port COMP_C

Not connected (* = marked no-connect by the designer): U11 13(OUT4)*

### Notes on the sheet
- (in symbol LM339DR, part A) -; +
- (in symbol LM339DR, part B) -; +
- (in symbol LM339DR, part C) -; +
- (in symbol LM339DR, part D) -; +

### Library data of the parts
CN7 = CONN_03P: 3 Pin Connector
R29-R37 = Resistor
TP32-TP40 = TestPoint
U11 = LM339DR: Comparator Standard Open-Collector 14-SOIC

## Nets that join several sheets
+1V5: ECU_AutoRC_PWR_SUPPLY_6A_r00 (C35.1 TP45.1 U13.5), ECU_AutoRC_STEMP_r00 (U3.5 U4.5)
+3V3: ECU_AutoRC_PWR_SUPPLY_6A_r00 (C39.1 R50.2 TP48.1 U15.2), ECU_AutoRC_UC0_r00 (15 pins), ECU_AutoRC_UC1_r00 (CN2.3), ECU_AutoRC_BLE_r00 (7 pins)
+5V: ECU_AutoRC_PWR_SUPPLY_6A_r00 (10 pins), ECU_AutoRC_UC1_r00 (CN2.1), ECU_AutoRC_STEMP_r00 (6 pins), ECU_AutoRC_MOT_DRIVER_r00 (C20.2 U7.1), ECU_AutoRC_MOT_BEMF_r00 (TP37.1 U11.3)
+8V4: ECU_AutoRC_PWR_SUPPLY_6A_r00 (9 pins), ECU_AutoRC_UC1_r00 (CN3.1)
GND: ECU_AutoRC_PWR_SUPPLY_6A_r00 (NT2.2), ECU_AutoRC_UC0_r00 (17 pins), ECU_AutoRC_UC1_r00 (CN2.2 CN2.4 CN3.3), ECU_AutoRC_STEMP_r00 (12 pins), ECU_AutoRC_BLE_r00 (27 pins), ECU_AutoRC_MOT_DRIVER_r00 (C20.1 U7.8)
PGND: ECU_AutoRC_PWR_SUPPLY_6A_r00 (24 pins), ECU_AutoRC_MOT_DRIVER_r00 (11 pins), ECU_AutoRC_MOT_BEMF_r00 (7 pins)
VCC: ECU_AutoRC_PWR_SUPPLY_6A_r00 (11 pins), ECU_AutoRC_MOT_DRIVER_r00 (14 pins)
IO0: ECU_AutoRC_UC1_r00 (U1.16), ECU_AutoRC_BLE_r00 (TP19.1 U6.12)
IO1: ECU_AutoRC_UC1_r00 (U1.17), ECU_AutoRC_BLE_r00 (TP20.1 U6.13)
IO2: ECU_AutoRC_UC1_r00 (U1.22), ECU_AutoRC_BLE_r00 (U6.5)
IO3: ECU_AutoRC_UC1_r00 (U1.21), ECU_AutoRC_BLE_r00 (U6.6)
IO10: ECU_AutoRC_UC1_r00 (U1.23), ECU_AutoRC_BLE_r00 (U6.16)
NetR6_1: ECU_AutoRC_UC1_r00 (U1.8), ECU_AutoRC_STEMP_r00 (R6.1 TP13.1 U5.1)
NetR8_2: ECU_AutoRC_UC1_r00 (U1.9), ECU_AutoRC_STEMP_r00 (R8.2 TP14.1 U5.7)
NetR48_2: ECU_AutoRC_PWR_SUPPLY_6A_r00 (R48.2 R49.1 TP47.1), ECU_AutoRC_UC1_r00 (U1.26)
NetTP23_1: ECU_AutoRC_UC1_r00 (U1.33), ECU_AutoRC_MOT_DRIVER_r00 (TP23.1 U7.2)
NetTP24_1: ECU_AutoRC_UC1_r00 (U1.34), ECU_AutoRC_MOT_DRIVER_r00 (TP24.1 U7.3)
NetTP26_1: ECU_AutoRC_UC1_r00 (U1.35), ECU_AutoRC_MOT_DRIVER_r00 (TP26.1 U7.4)
NetTP27_1: ECU_AutoRC_UC1_r00 (U1.37), ECU_AutoRC_MOT_DRIVER_r00 (TP27.1 U7.6)
NetTP28_1: ECU_AutoRC_UC1_r00 (U1.36), ECU_AutoRC_MOT_DRIVER_r00 (TP28.1 U7.5)
NetTP29_1: ECU_AutoRC_UC1_r00 (U1.42), ECU_AutoRC_MOT_DRIVER_r00 (TP29.1 U7.7)
NetTP36_1: ECU_AutoRC_UC1_r00 (U1.43), ECU_AutoRC_MOT_BEMF_r00 (TP36.1 U11.1)
NetTP39_1: ECU_AutoRC_UC1_r00 (U1.44), ECU_AutoRC_MOT_BEMF_r00 (TP39.1 U11.2)
NetTP40_1: ECU_AutoRC_UC1_r00 (U1.45), ECU_AutoRC_MOT_BEMF_r00 (TP40.1 U11.14)
PH_A: ECU_AutoRC_MOT_DRIVER_r00 (5 pins), ECU_AutoRC_MOT_BEMF_r00 (CN7.1 R29.1)
PH_B: ECU_AutoRC_MOT_DRIVER_r00 (5 pins), ECU_AutoRC_MOT_BEMF_r00 (CN7.2 R31.2)
PH_C: ECU_AutoRC_MOT_DRIVER_r00 (5 pins), ECU_AutoRC_MOT_BEMF_r00 (CN7.3 R33.2)
RXD0: ECU_AutoRC_UC1_r00 (U1.58), ECU_AutoRC_BLE_r00 (TP22.1 U6.30)
TXD0: ECU_AutoRC_UC1_r00 (U1.59), ECU_AutoRC_BLE_r00 (TP21.1 U6.31)